# EAGLE design GG-CC1101_v1.2 (EAGLE 6.4)
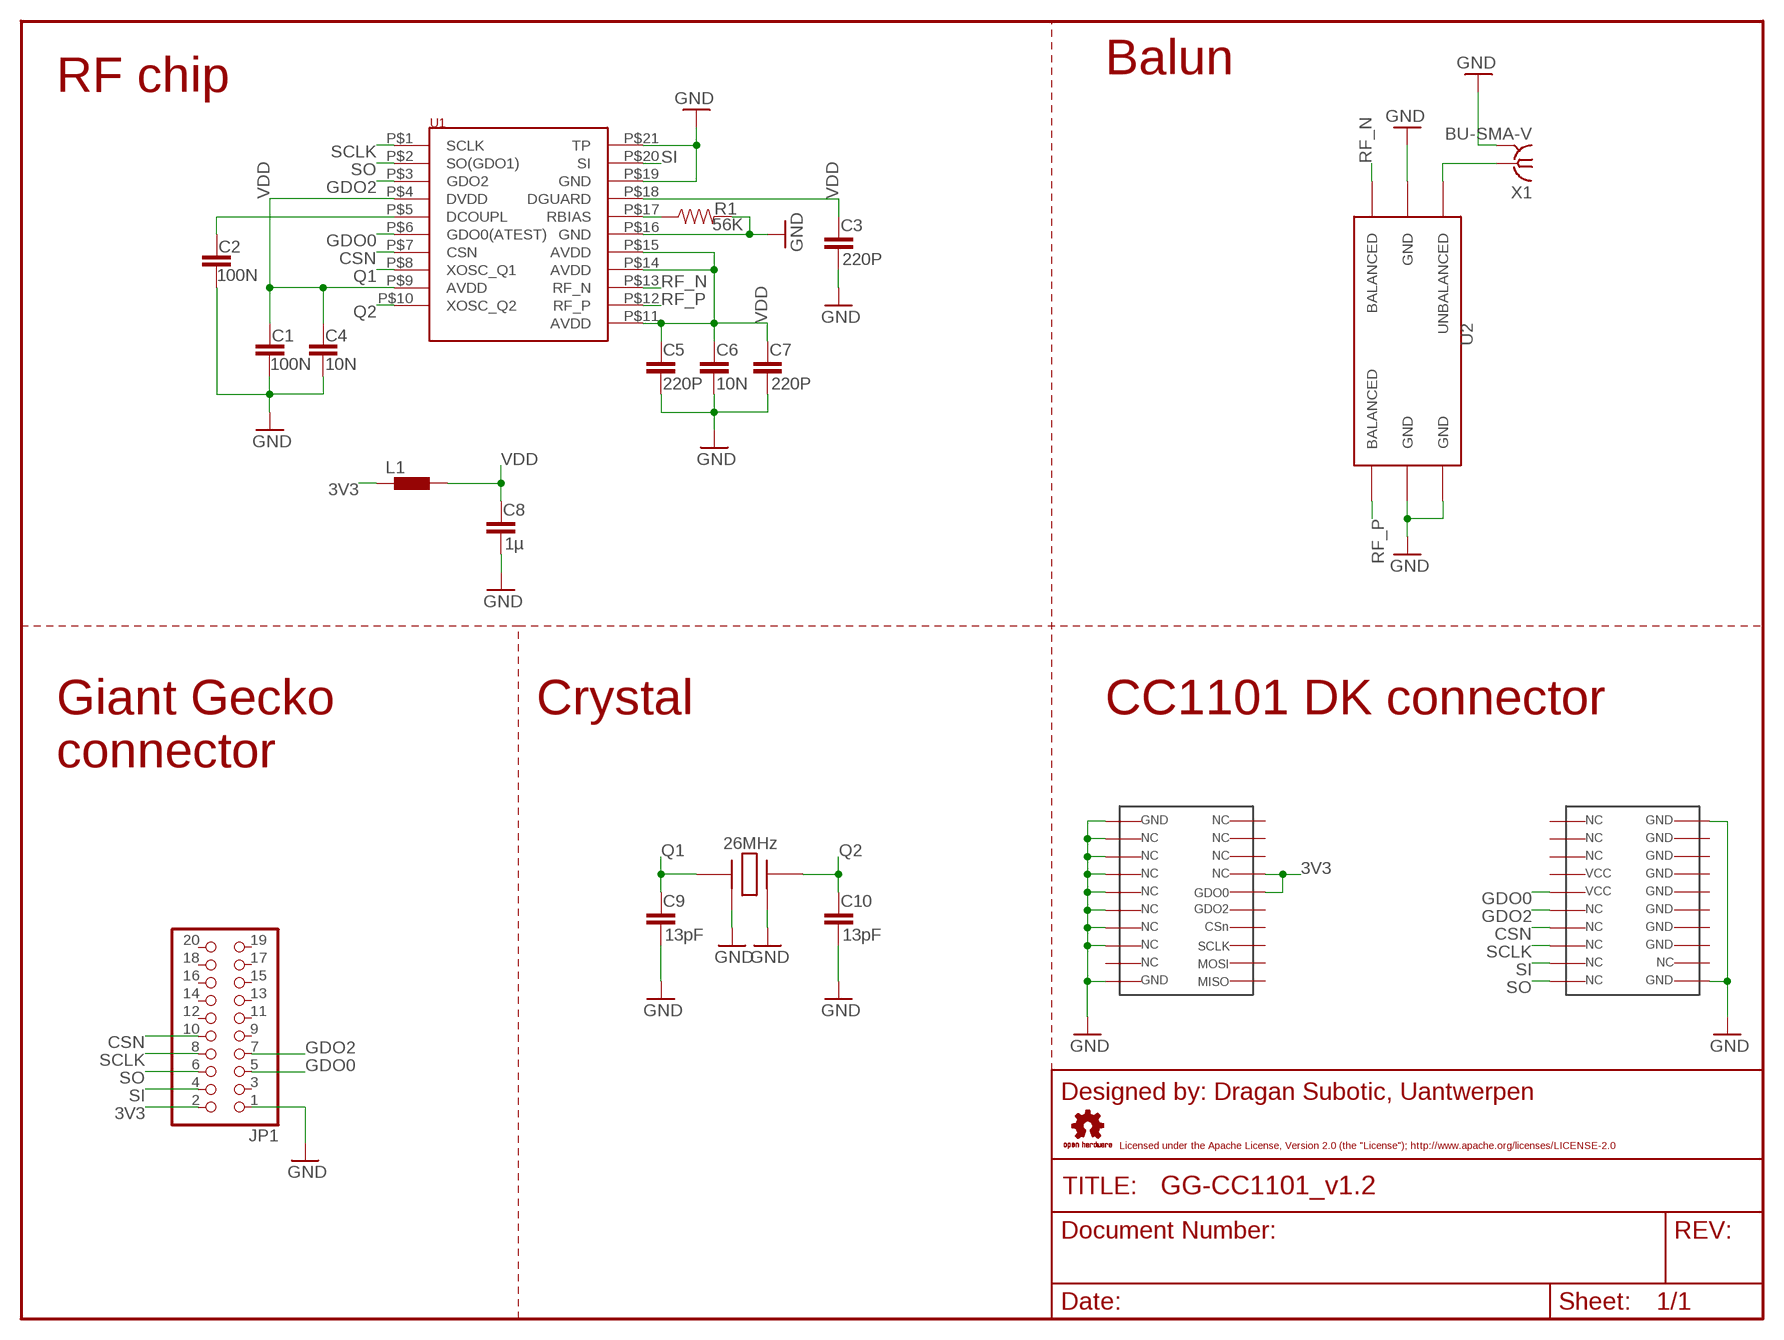
[diagram p0: schematic, sheet 1]

## Parts
C1  100N  CAP0805  [0805]
C2  100N  CAP0805  [0805]
C3  220P  CAP0805  [0805]
C4  10N  CAP0805  [0805]
C5  220P  CAP0805  [0805]
C6  10N  CAP0805  [0805]
C7  220P  CAP0805  [0805]
C8  1µ  CAP0805  [0805]
C9  13pF  CAP0805  [0805]
C10  13pF  CAP0805  [0805]
JP1  PINHD-2X10  [2X10]
L1  BLM15HG102SN1  [0402]
Q1  XTAL-26MHZ  [XTAL-26MHZ]
R1  56K  RESISTOR0805-RES  [0805]
U1  CC1101  [CC1101]
U2  BALUN-433MHZ  [BALUN-433MHZ]
U$1  CC1101-EVAL_KIT  [CC1101-EVAL_KIT]
X1  BU-SMA-V  [BU-SMA-V]

## Nets
3V3: JP1.2 L1.1 U$1.P$14 U$1.P$15
CSN: JP1.10 U1.P$7(CSN) U$1.P$24
GDO0: JP1.5 U1.P$6(GDO0(ATEST)) U$1.P$26
GDO2: JP1.7 U1.P$3(GDO2) U$1.P$25
GND: C1.2 C2.2 C3.2 C4.2 C5.2 C6.2 C7.2 C8.2 C9.2 C10.2 JP1.1 Q1.P$2 Q1.P$4 R1.2 U1.P$16(GND) U1.P$19(GND) U1.P$21(TP) U2.P$2(GND) U2.P$5(GND) U2.P$6(GND) U$1.P$1 U$1.P$3 U$1.P$4 U$1.P$5 U$1.P$6 U$1.P$7 U$1.P$8 U$1.P$9 U$1.P$10 U$1.P$31 U$1.P$40 X1.2 X1.3 X1.4 X1.5
N$5: C2.1 U1.P$5(DCOUPL)
N$6: R1.1 U1.P$17(RBIAS)
N$10: U2.P$1(UNBALANCED) X1.1
Q1: C9.1 Q1.P$1 U1.P$8(XOSC_Q1)
Q2: C10.1 Q1.P$3 U1.P$10(XOSC_Q2)
RF_N: U1.P$13(RF_N) U2.P$3(BALANCED)
RF_P: U1.P$12(RF_P) U2.P$4(BALANCED)
SCLK: JP1.8 U1.P$1(SCLK) U$1.P$23
SI: JP1.4 U1.P$20(SI) U$1.P$22
SO: JP1.6 U1.P$2(SO(GDO1)) U$1.P$21
VDD: C1.1 C3.1 C4.1 C5.1 C6.1 C7.1 C8.1 L1.2 U1.P$4(DVDD) U1.P$9(AVDD) U1.P$11(AVDD) U1.P$14(AVDD) U1.P$15(AVDD) U1.P$18(DGUARD)
Unconnected: JP1.3 JP1.9 JP1.11 JP1.12 JP1.13 JP1.14 JP1.15 JP1.16 JP1.17 JP1.18 JP1.19 JP1.20 U$1.P$2 U$1.P$11 U$1.P$12 U$1.P$13 U$1.P$16 U$1.P$17 U$1.P$18 U$1.P$19 U$1.P$20 U$1.P$27 U$1.P$28 U$1.P$29 U$1.P$30 U$1.P$32 U$1.P$33 U$1.P$34 U$1.P$35 U$1.P$36 U$1.P$37 U$1.P$38 U$1.P$39

## Notes on the sheet
- Balun
- RF chip
- Crystal | CC1101 DK connector
- Giant Gecko 
  connector
- 26MHz
- Designed by: Dragan Subotic, Uantwerpen
- Licensed under the Apache License, Version 2.0 (the "License"); http://www.apache.org/licenses/LICENSE-2.0

## Library data of the parts
C1-C10 = SparkFun:CAP: Capacitor Standard 0603 ceramic capacitor, and 0.1" leaded capacitor.
JP1 = pinhead:PINHD-2X10: PIN HEADER
L1 = inductors:BLM15H: EMIFIL (R) Chip Ferrite Bead for GHz Noise Source: http://www.murata.com/ Ferrite Bead BLM15H.pdf
Q1 = Dragan-Personal:XTAL-26MHZ
R1 = SparkFun:RESISTOR: Resistor Basic schematic elements and footprints for 0603, 1206, and PTH resistors.
U1 = PersonalLibrary (2):CC1101
U2 = PersonalLibrary (2):BALUN-433MHZ
U$1 = Dragan-Personal:CC1101-EVAL_KIT
X1 = con-coax:BU-SMA-V: FEMALE SMA CONNECTOR Radiall distributor RS 112-3794; OC_FARNELL: unknown; OC_NEWARK: unknown

## Board
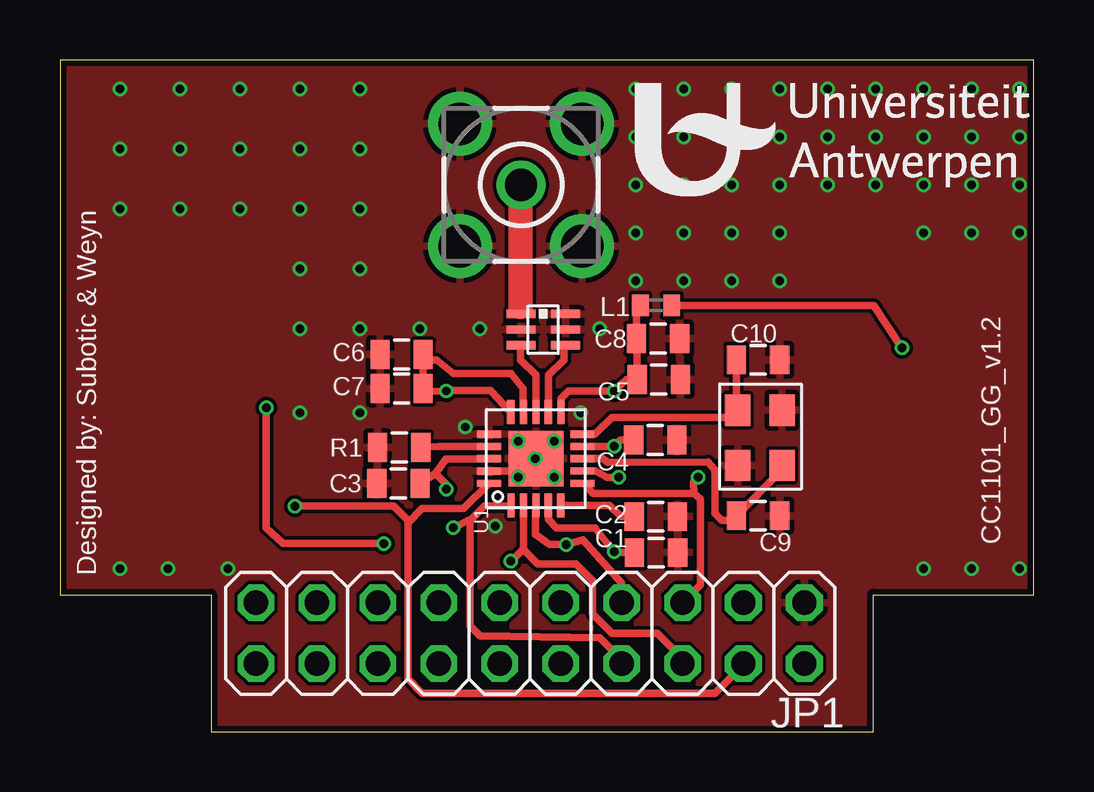
[diagram p1: board, top side]
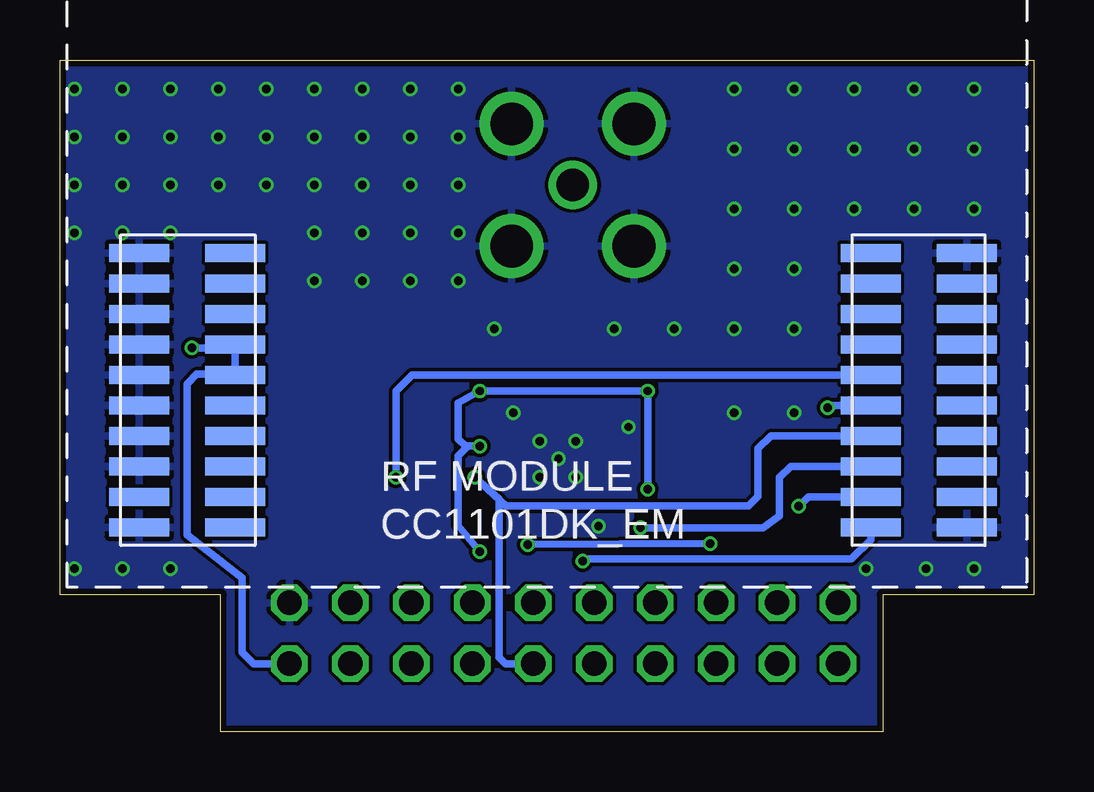
[diagram p2: board, bottom side, seen from below]

Size 40.6 x 28 mm. Coordinates in mm from the lower left corner, seen from the top.
Outline: 40.6,5.7 40.6,28 0,28 0,5.7 6.3,5.7 6.3,0 33.9,0 33.9,5.7 40.6,5.7
Copper layers (1*16): Top 0.018mm / dielectric 1.55mm / Bottom 0.018mm
Design rules "eC_2Layer_PClass6_BaseCopperO18_eCDefault": minimum track width 0.15mm, minimum drill 0.35mm, track to track 0.15mm, track to pad 0.15mm, pad to pad 0.15mm, via to via 0.15mm, smd to smd 0mil, copper to edge 0.25mm, drill to drill 0.35mm, minimum pad ring 0.175mm, minimum via ring 0.125mm, stop-mask expansion 0mil, vias tented up to drill 0.45mm, thermal gap 0.2mm

### Footprints (pad centres in the part's own frame; a part is rotated, then mirrored left to right if it is on the bottom)
0805 = smd 0.8 x 1.2: 1 -0.9,0; 2 0.9,0
2X10 = drill 1.016 octagon: 1 -11.43,-1.27; 2 -11.43,1.27; 3 -8.89,-1.27; 4 -8.89,1.27; 5 -6.35,-1.27; 6 -6.35,1.27; 7 -3.81,-1.27; 8 -3.81,1.27; 9 -1.27,-1.27; 10 -1.27,1.27; 11 1.27,-1.27; 12 1.27,1.27; 13 3.81,-1.27; 14 3.81,1.27; 15 6.35,-1.27; 16 6.35,1.27; 17 8.89,-1.27; 18 8.89,1.27; 19 11.43,-1.27; 20 11.43,1.27
0402 = smd 0.7 x 0.9: 1 -0.65,0; 2 0.65,0
XTAL-26MHZ = smd 1.3 x 1.05: P$1 0,0; P$2 2.3,0; P$3 2.3,1.85; P$4 0,1.85
CC1101 = smd 1 x 0.3: P$1 0.273,3.252; P$2 0.273,2.743; P$3 0.273,2.223; P$4 0.273,1.702; P$5 0.273,1.183; P$11 4.173,1.173; P$12 4.173,1.702; P$13 4.173,2.223; P$14 4.173,2.743; P$15 4.173,3.272 | smd 0.3 x 1: P$6 1.192,0.273; P$7 1.712,0.273; P$8 2.223,0.273; P$9 2.732,0.273; P$10 3.243,0.273; P$16 3.243,4.173; P$17 2.732,4.173; P$18 2.223,4.173; P$19 1.702,4.173; P$20 1.192,4.183 | smd 2.3 x 2.3: P$21 2.223,2.223
BALUN-433MHZ = smd 0.35 x 1.2: P$1 0,0.3; P$2 -0.65,0.3; P$3 -1.3,0.3; P$4 -1.3,-1.55; P$5 -0.65,-1.55; P$6 0,-1.55
CC1101-EVAL_KIT = smd 2.5 x 0.75: P$1 0,0; P$2 0,1.27; P$3 0,2.54; P$4 0,3.81; P$5 0,5.08; P$6 0,6.35; P$7 0,7.62; P$8 0,8.89; P$9 0,10.16; P$10 0,11.43; P$11 4,11.43; P$12 4,10.16; P$13 4,8.89; P$14 4,7.62; P$15 4,6.35; P$16 4,5.08; P$17 4,3.81; P$18 4,2.54; P$19 4,1.27; P$20 4,0; P$21 30.5,0; P$22 30.5,1.27; P$23 30.5,2.54; P$24 30.5,3.81; P$25 30.5,5.08; P$26 30.5,6.35; P$27 30.5,7.62; P$28 30.5,8.89; P$29 30.5,10.16; P$30 30.5,11.43; P$31 34.5,11.43; P$32 34.5,10.16; P$33 34.5,8.89; P$34 34.5,7.62; P$35 34.5,6.35; P$36 34.5,5.08; P$37 34.5,3.81; P$38 34.5,2.54; P$39 34.5,1.27; P$40 34.5,0
BU-SMA-V = drill 1.35: 1 0,0 | drill 1.778: 2 -2.55,2.55; 3 2.55,2.55; 4 2.55,-2.55; 5 -2.55,-2.55

### Placement (x,y rotation side)
C1  24.85,7.46 0 top
C2  24.84,8.96 0 top
C3  14.11,10.35 180 top
C4  24.82,12.16 0 top
C5  24.96,14.68 0 top
C6  14.24,15.72 180 top
C7  14.24,14.3 180 top
C8  24.93,16.38 0 top
C9  29.1,9 0 top
C10  29.1,15.5 0 top
JP1  19.6,4.1 180 top
L1  24.85,17.77 180 top
Q1  30.1,11.1 90 top
R1  14.14,11.84 180 top
U1  22.06,9.15 90 top
U2  19.52,17.41 90 top
U$1  37.3,8.52 0 bottom
X1  19.22,22.79 0 top

### Tracks (layer width: path | path; a pad name or v marks a point on that pad's centre or on a via)
3V3  (via drill 0.35)
  Top 0.305: L1.1 33.93,17.77 v35.1,16
  Bottom 0.305: v35.1,16 33.44,16 U$1.P$14 U$1.P$15 33.33,14.9 34.9,14.9 35.3,14.5 35.3,8.2 33,6.4 33,3.3 32.53,2.83 JP1.2
CSN  (via drill 0.35)
  Top 0.305: U1.P$7 22.33,10.87 22.8,10.6 v23.3,10.6
  Bottom 0.305: U$1.P$24 10.97,12.33 11.5,11.8 11.5,9.8 11.9,9.4 22,9.4 v23.3,10.6 22.3,9.7 22.3,3.1 22.03,2.83 JP1.10
GDO0  (via drill 0.35)
  Top 0.305: U1.P$6 21.85,10.35 22.22,9.93 26.42,9.93 | 26.42,9.93 26.7,9.7 26.7,6.12 JP1.5 | 26.42,9.93 26.4,10.4 v26.6,10.6
  Bottom 0.305: U$1.P$26 25.93,14.87 26.6,14.2 v26.6,10.6
GDO2  (via drill 0.35)
  Top 0.305: U1.P$3 19.83,9.38 19.83,8.21 20.4,7.8 v21.1,7.8 21.8,8 23.41,6.19 23.41,6.03 | v8.6,13.5 8.6,8.5 9.31,7.85 v13.5,7.84 | 23.41,5.99 23.39,6.01 23.41,6.03 | JP1.7 23.41,6.03
  Bottom 0.305: U$1.P$25 8.5,13.6 v8.6,13.5 | v13.5,7.84 v21.1,7.8
GND  (via drill 0.35)
  Top 0.305: U1.P$19 18.84,10.86 v19.1,10.6 | v19.82,11.37 v19.83,11.37 U1.P$21
  other vias: 16.9,12.7 19.1,12.1 20.6,12.1 20.6,10.6 2.5,26.8 2.5,24.3 2.5,21.8 5,26.8 5,24.3 5,21.8 7.5,26.8 7.5,24.3 7.5,21.8 10,26.8 10,24.3 10,21.8 12.5,26.8 12.5,24.3 12.5,21.8 10,19.3 10,16.8 12.5,16.8 12.5,19.3 15,16.8 17.5,16.8 18.15,8.57 22.5,16.8 26,18.8 40,26.8 38,26.8 36,26.8 34,26.8 32,26.8 30,26.8 28,26.8 24,26.8 24,24.8 24,22.8 24,20.8 24,18.8 28,18.8 30,18.8 26,20.8 28,20.8 30,20.8 26,22.8 28,22.8 30,22.8 32,22.8 34,22.8 36,22.8 38,22.8 40,22.8 26,26.8 26,24.8 28,24.8 30,24.8 32,24.8 34,24.8 36,24.8 38,24.8 40,24.8 38,20.8 36,20.8 40,20.8 10,13.3 12.5,13.3 36,6.8 40,6.8 38,6.8 2.5,6.8 4.5,6.8 7,6.8 21.7,13.3
  pour Top: -3.5,29 43.5,29 43.5,-2 -3.5,-2
  pour Bottom: -3.5,29 43.5,29 43.5,-2 -3.5,-2
N$5
  Top 0.305: U1.P$5 22.91,9.43 23.38,8.96 C2.1
N$6
  Top 0.305: R1.1 15.82,11.88 17.8,11.88 U1.P$17
N$10
  Top 0.15: U2.P$1 19.22,17.68 19.2,17.7
  Top 1.016: 19.2,17.7 19.2,22.57 X1.1
Q1
  Top 0.305: U1.P$8 22.62,11.38 22.84,11.22 27,11.24 27.3,10.9 27.3,9.1 27.6,8.8 28,8.8 C9.1 30.1,10.9 Q1.P$1
Q2
  Top 0.305: U1.P$10 22.3,12.4 23,13.1 27.95,13.1 Q1.P$3 28.2,13.45 C10.1
RF_N
  Top 0.305: U1.P$13 19.84,14.86 19.2,15.5 19.2,16.09 U2.P$3
RF_P
  Top 0.305: U1.P$12 20.36,14.86 21,15.5 21,16.04 U2.P$4
SCLK  (via drill 0.35)
  Top 0.305: 17.1,8.8 17.1,4.4 17.5,4 22.5,3.9 23.41,2.99 JP1.8 | 17.1,8.8 17.7,9.4 18.78,9.4 U1.P$1 | 17.1,8.8 17,8.8 v16.4,8.5
  Bottom 0.305: U$1.P$23 10.14,11.06 10.6,10.6 10.6,9 11.3,8.5 v16.4,8.5
SI  (via drill 0.35)
  Top 0.305: 14.5,8.7 14.5,2.2 15.1,1.6 27.3,1.6 28.49,2.79 JP1.4 | 14.5,8.7 15.1,9.3 16.83,9.3 U1.P$20 | 14.5,8.7 14.5,8.8 13.9,9.4 v9.8,9.4
  Bottom 0.305: U$1.P$22 9.41,9.79 v9.8,9.4
SO  (via drill 0.35)
  Top 0.305: 19.32,7.6 19.9,7 21.5,7 22.2,6.3 22.2,4.9 23,4.1 24.9,4.1 25.95,3.05 JP1.6 | 19.32,7.6 19.32,9.41 U1.P$2 | 19.32,7.6 19.3,7.6 v18.8,7.1
  Bottom 0.305: U$1.P$21 6.8,8 7.6,7.2 18.7,7.2 v18.8,7.1
VDD  (via drill 0.35)
  Top 0.305: U1.P$14 19.3,13.35 19.3,14.3 18.8,14.92 16.4,14.92 15.7,15.5 15.17,15.5 C6.1 15.15,14.09 C7.1 15.52,14.18 v16.1,14.2 v16.1,14.21 17.94,14.21 U1.P$15 | C3.1 15.66,10.76 | 15.66,10.76 16.09,11.37 17.66,11.37 U1.P$18 | 15.66,10.76 16.1,10.32 v16.1,10.1 | C4.1 23.36,12.16 v23.1,11.9 23.09,11.89 U1.P$9 | C1.1 23.16,7.46 v23.1,7.5 22.3,8.5 20.7,8.5 20.36,8.84 U1.P$4 | U1.P$11 20.89,13.89 21.2,14.2 v23.1,14.2 23.62,14.68 C5.1 24.06,16.35 C8.1 24.03,17.6 L1.2
  Bottom 0.305: v23.1,7.5 24,8.6 24,11.5 23.6,11.9 v23.1,11.9 23.7,11.9 24,12.2 24,13.7 23.3,14.1 v23.1,14.2 v16.1,14.2 v16.1,10.1

### Text on the board
tPlace: CC1101_GG_v1.2 | Designed by: Subotic & Weyn